# EAGLE design ethernet-frontend (EAGLE 5.09)
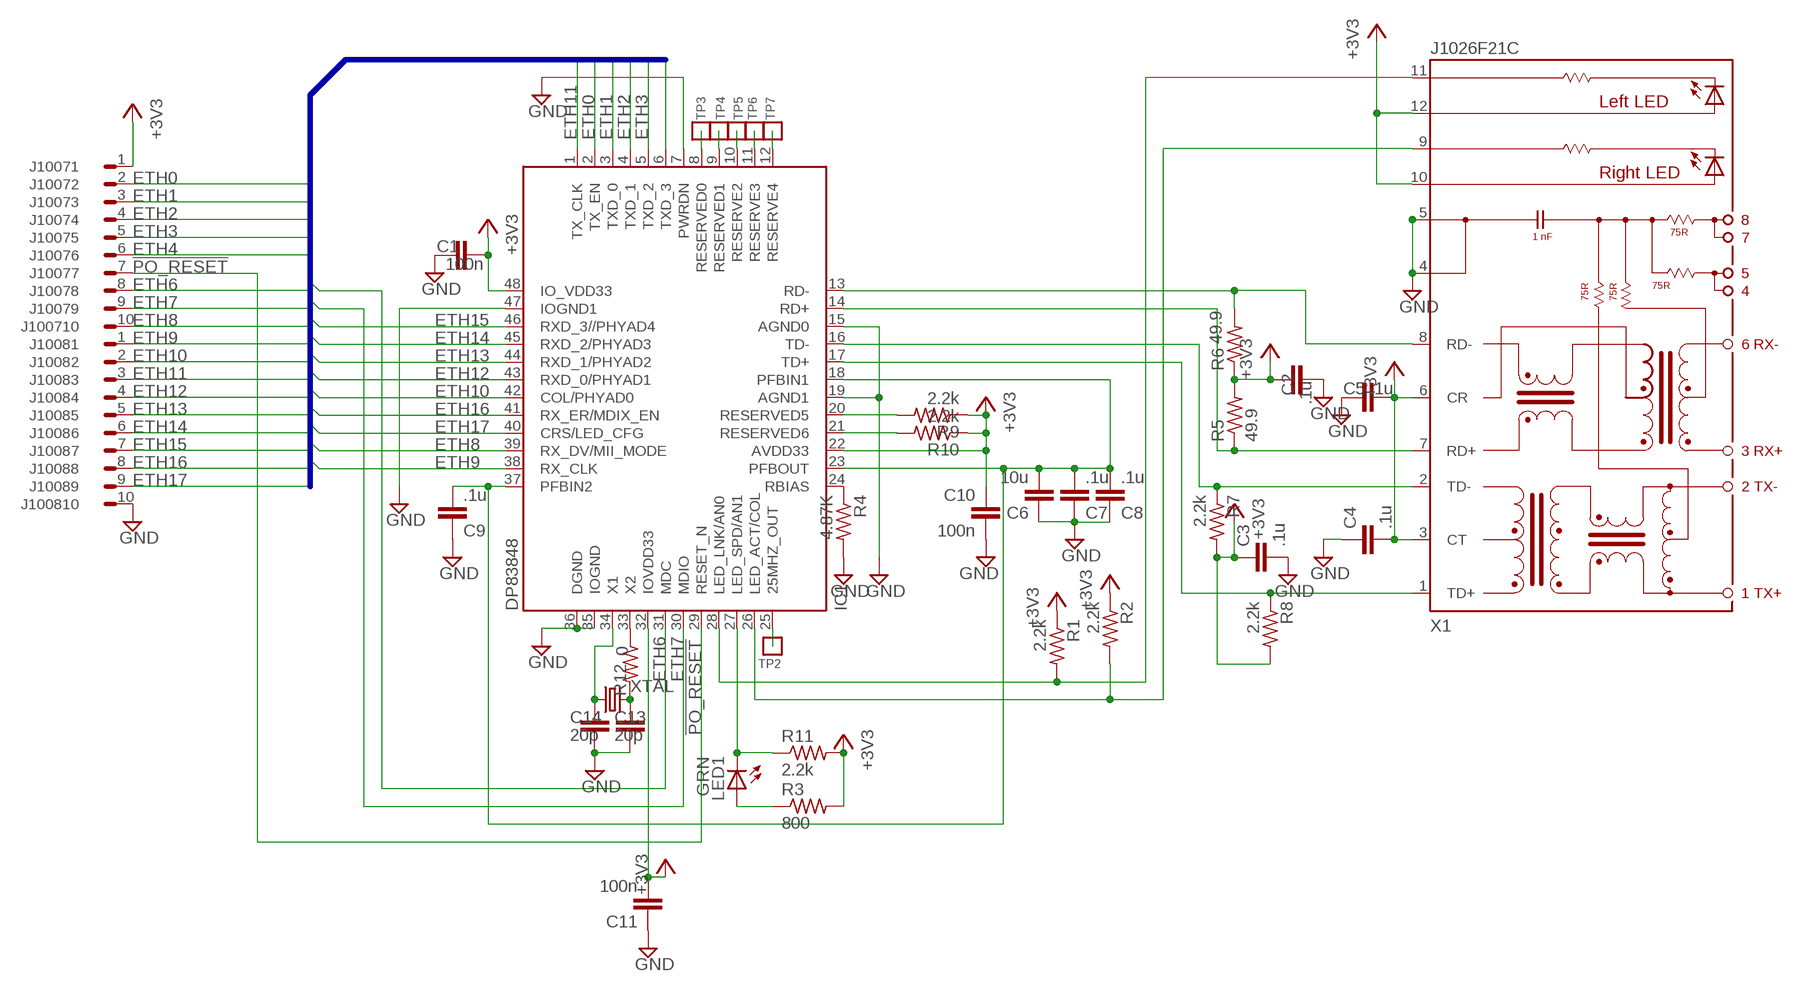
[diagram p0: schematic, sheet 1]

## Parts
C1  100n  C-EU0603-B-NOSILK  [0603-B-NOSILK]
C2  .1u  C-EU0603-B-NOSILK  [0603-B-NOSILK]
C3  .1u  C-EU0603-B-NOSILK  [0603-B-NOSILK]
C4  .1u  C-EU0603-B-NOSILK  [0603-B-NOSILK]
C5  .1u  C-EU0603-B-NOSILK  [0603-B-NOSILK]
C6  10u  C-EU0805-B-NOSILK  [0805-B-NOSILK]
C7  .1u  C-EU0603-B-NOSILK  [0603-B-NOSILK]
C8  .1u  C-EU0603-B-NOSILK  [0603-B-NOSILK]
C9  .1u  C-EU0603-B-NOSILK  [0603-B-NOSILK]
C10  100n  C-EU0603-B-NOSILK  [0603-B-NOSILK]
C11  100n  C-EU0603-B-NOSILK  [0603-B-NOSILK]
C13  20p  C-EU0603-B-NOSILK  [0603-B-NOSILK]
C14  20p  C-EU0603-B-NOSILK  [0603-B-NOSILK]
IC1  DP83848  [LQFP48]
J1007  1_10_CON  [1_10_CON]
J1008  1_10_CON  [1_10_CON]
LED1  GRN  LEDCHIPLED_0603  [CHIPLED_0603]
R1  2.2k  R-US_0603-B-NOSILK  [0603-B-NOSILK]
R2  2.2k  R-US_0603-B-NOSILK  [0603-B-NOSILK]
R3  800  R-US_0603-B-NOSILK  [0603-B-NOSILK]
R4  4.87K  R-US_0603-B-NOSILK  [0603-B-NOSILK]
R5  49.9  R-US_0603-B-NOSILK  [0603-B-NOSILK]
R6  49.9  R-US_0603-B-NOSILK  [0603-B-NOSILK]
R7  2.2k  R-US_0603-B-NOSILK  [0603-B-NOSILK]
R8  2.2k  R-US_0603-B-NOSILK  [0603-B-NOSILK]
R9  2.2k  R-US_0603-B-NOSILK  [0603-B-NOSILK]
R10  2.2k  R-US_0603-B-NOSILK  [0603-B-NOSILK]
R11  2.2k  R-US_0603-B-NOSILK  [0603-B-NOSILK]
R12  0  R-US_0603-B-NOSILK  [0603-B-NOSILK]
TP2  TEST  [TEST]
TP3  TEST  [TEST]
TP4  TEST  [TEST]
TP5  TEST  [TEST]
TP6  TEST  [TEST]
TP7  TEST  [TEST]
X1  J1026F21C  [J1]
XTAL  CRYSTAL_SMD_  [CRYSTAL_SMD]

## Nets
!PO_RESET: IC1.29(RESET_N) J1007.7
+3V3: C1.2 C2.1 C3.1 C4.2 C5.2 C10.1 C11.2 IC1.22(AVDD33) IC1.32(IOVDD33) IC1.48(IO_VDD33) J1007.1 R1.1 R2.1 R3.2 R5.2 R6.1 R7.2 R8.2 R9.1 R10.1 R11.2 X1.3(CT) X1.6(CR) X1.10(A-R) X1.12(A-L)
ETH0: IC1.2(TX_EN) J1007.2
ETH1: IC1.3(TXD_0) J1007.3
ETH2: IC1.4(TXD_1) J1007.4
ETH3: IC1.5(TXD_2) J1007.5
ETH4: IC1.6(TXD_3) J1007.6
ETH6: IC1.31(MDC) J1007.8
ETH7: IC1.30(MDIO) J1007.9
ETH8: IC1.39(RX_DV/MII_MODE) J1007.10
ETH9: IC1.38(RX_CLK) J1008.1
ETH10: IC1.42(COL/PHYAD0) J1008.2
ETH11: IC1.1(TX_CLK) J1008.3
ETH12: IC1.43(RXD_0/PHYAD1) J1008.4
ETH13: IC1.44(RXD_1/PHYAD2) J1008.5
ETH14: IC1.45(RXD_2/PHYAD3) J1008.6
ETH15: IC1.46(RXD_3//PHYAD4) J1008.7
ETH16: IC1.41(RX_ER/MDIX_EN) J1008.8
ETH17: IC1.40(CRS/LED_CFG) J1008.9
GND: C1.1 C2.2 C3.2 C4.1 C5.1 C6.1 C7.1 C8.1 C9.1 C10.2 C11.1 C13.1 C14.1 IC1.7(PWRDN) IC1.15(AGND0) IC1.19(AGND1) IC1.35(IOGND) IC1.36(DGND) IC1.47(IOGND1) J1008.10 R4.2 X1.4 X1.5
N$1: IC1.20(RESERVED5) R9.2
N$2: IC1.24(RBIAS) R4.1
N$3: IC1.16(TD-) R7.1 X1.2(TD-)
N$4: IC1.17(TD+) R8.1 X1.1(TD+)
N$5: IC1.13(RD-) R6.2 X1.8(RD-)
N$6: IC1.14(RD+) R5.1 X1.7(RD+)
N$7: IC1.26(LED_ACT/COL) R2.2 X1.9(C-R)
N$10: IC1.21(RESERVED6) R10.2
N$11: C6.2 C7.2 C8.2 C9.2 IC1.18(PFBIN1) IC1.23(PFBOUT) IC1.37(PFBIN2)
N$12: IC1.28(LED_LNK/AN0) R1.2 X1.11(C-L)
N$13: IC1.27(LED_SPD/AN1) LED1.C R11.1
N$14: LED1.A R3.1
N$16: IC1.25(25MHZ_OUT) TP2.P$1
N$17: IC1.8(RESERVED0) TP3.P$1
N$18: IC1.9(RESERVED1) TP4.P$1
N$19: IC1.10(RESERVE2) TP5.P$1
N$20: IC1.11(RESERVE3) TP6.P$1
N$21: IC1.12(RESERVE4) TP7.P$1
N$22: IC1.33(X2) R12.1
N$23: C13.2 R12.2 XTAL.4
XTAL: C14.2 IC1.34(X1) XTAL.2

## Buses
ETH[0..17]

## Library data of the parts
C1-C11 C13 C14 = rcl_custom:C-EU: CAPACITOR, European symbol
IC1 = national-semiconductor:DP83848: PHYTER® - Extended Temperature Single Port 10/100 Mb/s Ethernet Physical Layer Transceiver Auto generated by make-symbol-device-package-bsdl.ulp Rev. 34 Source: dp83848yb.bsdl http://www.national.com/ds/DP/DP83848VYB.pdf
J1007 J1008 = 1_10_CON:1_10_CON
LED1 = led:LED: LED OSRAM: - CHIPLED LG R971, LG N971, LY N971, LG Q971, LY Q971, LO R971, LY R971 LH N974, LH R974 LS Q976, LO Q976, LY Q976 LO Q996 - Hyper CHIPLED LW Q18S LB Q993, LB Q99A, LB R99A - SideLED LS A670, LO A670, LY A670, LG A670, LP A670 LB A673, LV A673, LT A673, LW A673 LH A674 LY A675 LS A676, LA A676, LO A676, LY A676, LW A676 LS A679, LY A679, LG A679 - Hyper Micro SIDELED® LS Y876, LA Y876, LO Y876, LY Y876 LT Y87S - SmartLED LW L88C, LW L88S LB L89C, LB L89S, LG L890 LS L89K, LO L89K, LY L89K LS L896, LA L896, LO L896, LY L896 - TOPLED LS T670, LO T670, LY T670, LG T670, LP T670 LSG T670, LSP T670, LSY T670, LOP T670, LYG T670 LG T671, LOG T671, LSG T671 LB T673, LV T673, LT T673, LW T673 LH T674 LS T676, LA T676, LO T676, LY T676, LB T676, LH T676, LSB T676, LW T676 LB T67C, LV T67C, LT T67C, LS T67K, LO T67K, LY T67K, LW E67C LS E67B, LA E67B, LO E67B, LY E67B, LB E67C, LV E67C, LT E67C LW T67C LS T679, LY T679, LG T679 LS T770, LO T770, LY T770, LG T770, LP T770 LB T773, LV T773, LT T773, LW T773 LH T774 LS E675, LA E675, LY E675, LS T675 LS T776, LA T776, LO T776, LY T776, LB T776 LHGB T686 LT T68C, LB T68C - Hyper Mini TOPLED® LB M676 - Mini TOPLED Santana® LG M470 LS M47K, LO M47K, LY M47K Source: http://www.osram.convergy.de LUXEON: - LUMILED® LXK2-PW12-R00, LXK2-PW12-S00, LXK2-PW14-U00, LXK2-PW14-V00 LXK2-PM12-R00, LXK2-PM12-S00, LXK2-PM14-U00 LXK2-PE12-Q00, LXK2-PE12-R00, LXK2-PE12-S00, LXK2-PE14-T00, LXK2-PE14-U00 LXK2-PB12-K00, LXK2-PB12-L00, LXK2-PB12-M00, LXK2-PB14-N00, LXK2-PB14-P00, LXK2-PB14-Q00 LXK2-PR12-L00, LXK2-PR12-M00, LXK2-PR14-Q00, LXK2-PR14-R00 LXK2-PD12-Q00, LXK2-PD12-R00, LXK2-PD12-S00 LXK2-PH12-R00, LXK2-PH12-S00 LXK2-PL12-P00, LXK2-PL12-Q00, LXK2-PL12-R00 Source: www.luxeon.com KINGBRIGHT: KA-3528ASYC Source: www.kingbright.com
R1-R12 = rcl_custom:R-US_: RESISTOR, American symbol
TP2-TP7 = tqm1:TEST
X1 = con-pulse:J1026F: PULSEJACK (TM) 1x1 Tab-UP RJ45 10/100 Base-TX RJ45 1x1 Tab-UP with LEDs 8-pin (J1 series) and 6-pin (JP series) integrated magnetics connector, designed to support applications, such as ADSL modems, LAN-on-Motherboard, and Hub and Switches. Source: www.pulseeng.com .. PulseJack-J402.pdf
XTAL = Crystal_Pierre:CRYSTAL_SMD: Crystal

## Board
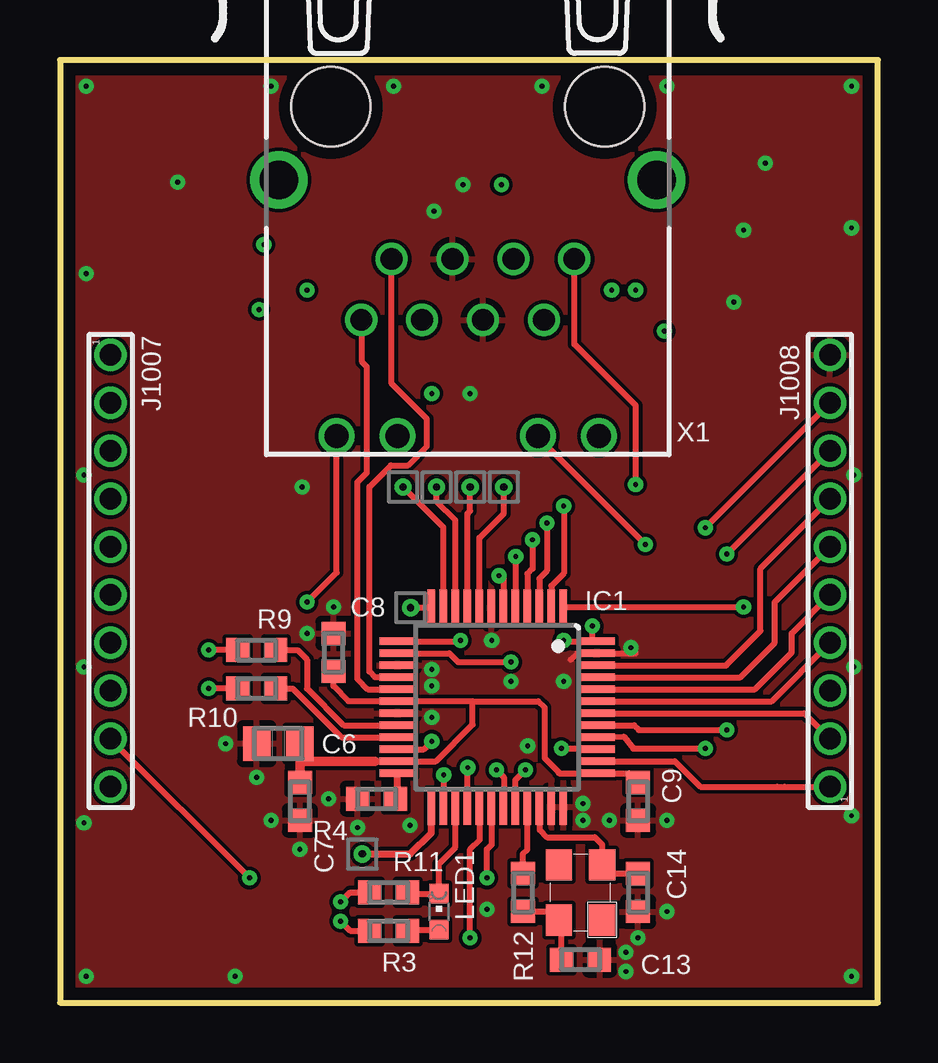
[diagram p1: board, top side]
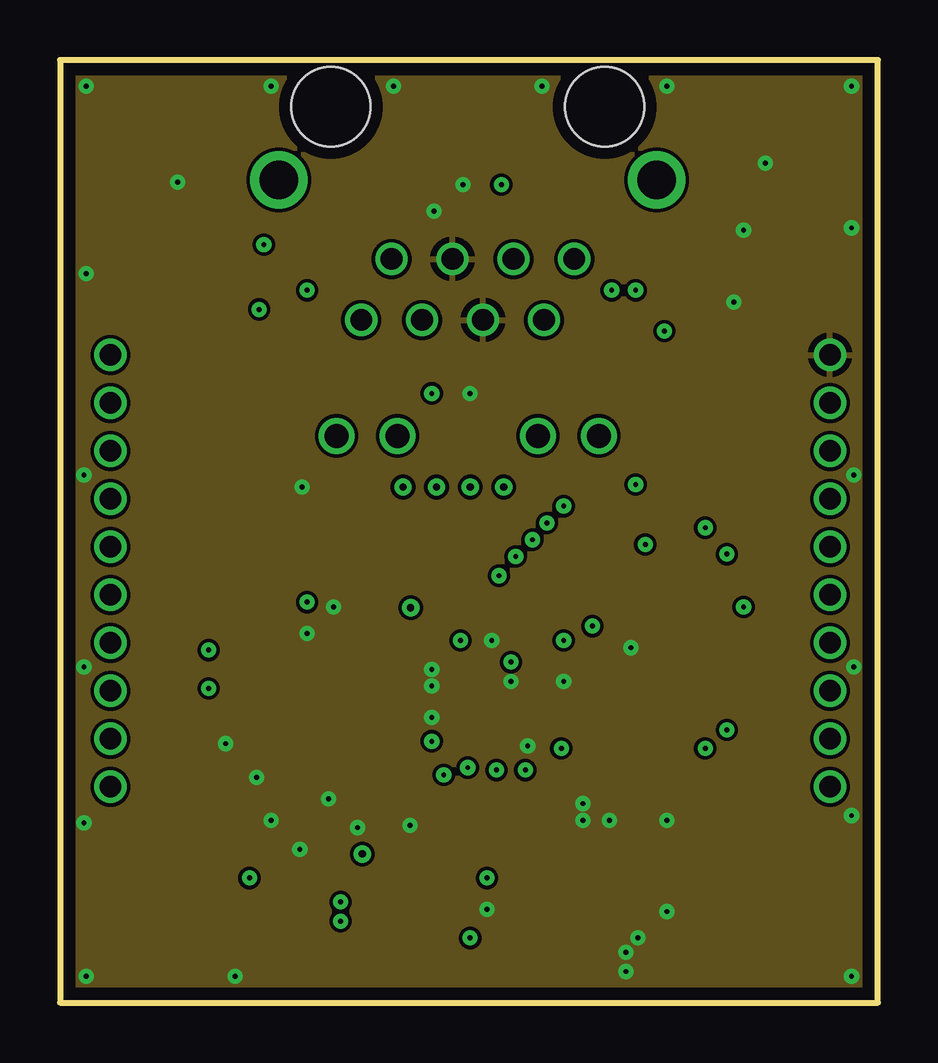
[diagram p2: board, inner layer Route2]
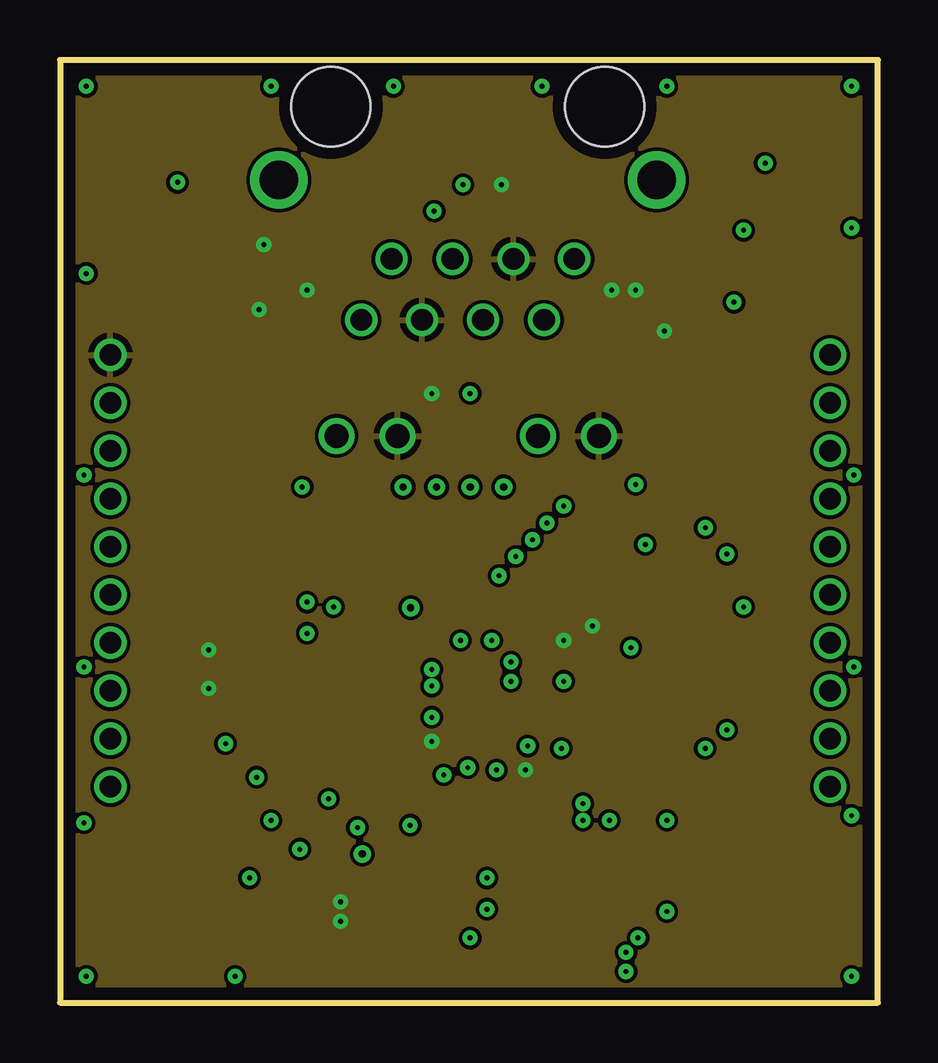
[diagram p3: board, inner layer Route3]
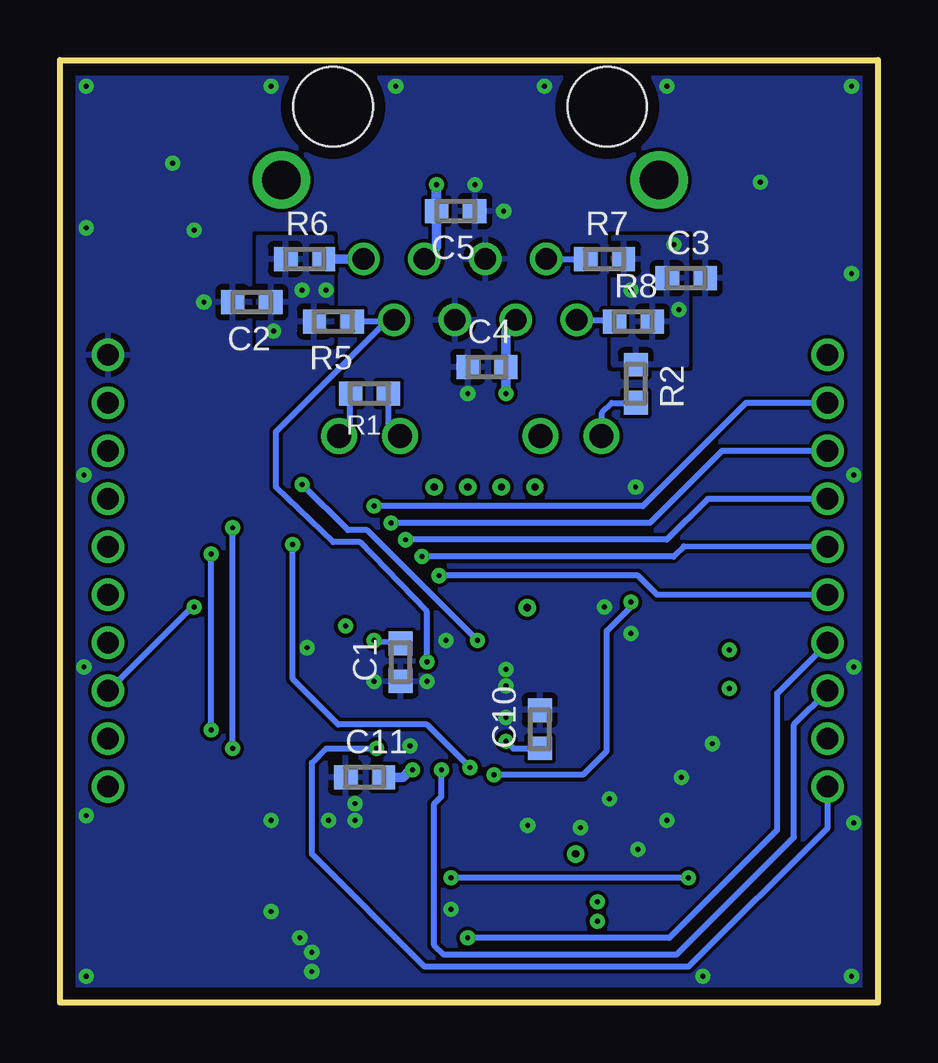
[diagram p4: board, bottom side, seen from below]

Size 34.1 x 39.3 mm. Coordinates in mm from the lower left corner, seen from the top.
Outline: 0,0 34.1,0 34.1,39.3 0,39.3 0,0
Copper layers (1+2*3+16): Top 0.0432mm / dielectric 0.3048mm / Route2 0.0356mm / dielectric 0.7112mm / Route3 0.0356mm / dielectric 0.3048mm / Bottom 0.0432mm
Design rules "sunstone_4lr_rules_v1.3_modifid": minimum track width 6mil, minimum drill 8mil, track to track 6mil, track to pad 6mil, pad to pad 6mil, via to via 6mil, smd to smd 6mil, copper to edge 20mil, drill to drill 16mil, minimum pad ring 0.2118mm, minimum via ring 0.2118mm, stop-mask expansion 3mil, vias tented up to drill 0mil, thermal gap 10mil

### Footprints (pad centres in the part's own frame; a part is rotated, then mirrored left to right if it is on the bottom)
0603-B-NOSILK = smd 0.95 x 1: 1 -0.8,0; 2 0.8,0
0805-B-NOSILK = smd 1.15 x 1.45: 1 -0.9,0; 2 0.9,0
LQFP48 = smd 1.5 x 0.3: 1 -4.15,2.75; 2 -4.15,2.25; 3 -4.15,1.75; 4 -4.15,1.25; 5 -4.15,0.75; 6 -4.15,0.25; 7 -4.15,-0.25; 8 -4.15,-0.75; 9 -4.15,-1.25; 10 -4.15,-1.75; 11 -4.15,-2.25; 12 -4.15,-2.75; 25 4.15,-2.75; 26 4.15,-2.25; 27 4.15,-1.75; 28 4.15,-1.25; 29 4.15,-0.75; 30 4.15,-0.25; 31 4.15,0.25; 32 4.15,0.75; 33 4.15,1.25; 34 4.15,1.75; 35 4.15,2.25; 36 4.15,2.75 | smd 0.3 x 1.5: 13 -2.75,-4.15; 14 -2.25,-4.15; 15 -1.75,-4.15; 16 -1.25,-4.15; 17 -0.75,-4.15; 18 -0.25,-4.15; 19 0.25,-4.15; 20 0.75,-4.15; 21 1.25,-4.15; 22 1.75,-4.15; 23 2.25,-4.15; 24 2.75,-4.15; 37 2.75,4.15; 38 2.25,4.15; 39 1.75,4.15; 40 1.25,4.15; 41 0.75,4.15; 42 0.25,4.15; 43 -0.25,4.15; 44 -0.75,4.15; 45 -1.25,4.15; 46 -1.75,4.15; 47 -2.25,4.15; 48 -2.75,4.15
1_10_CON = drill 0.9 pad 1.27 round: 1 -9,0; 2 -7,0; 3 -5,0; 4 -3,0; 5 -1,0; 6 1,0; 7 3,0; 8 5,0; 9 7,0; 10 9,0
CHIPLED_0603 = smd 0.8 x 0.8: A 0,-0.75; C 0,0.75
TEST = drill 0.3 round: P$1 0,0
J1 = drill 0.9 pad 1.3 round: 1 4.445,2.54; 2 3.175,0; 3 1.905,2.54; 4 0.635,0; 5 -0.635,2.54; 6 -1.905,0; 7 -3.175,2.54; 8 -4.445,0 | drill 1 pad 1.422 round: 9 5.465,7.37; 10 2.925,7.37; 11 -2.925,7.37; 12 -5.465,7.37 | drill 1.6 pad 2.184 round: M1 -7.875,-3.3; M2 7.875,-3.3 | hole 3.3: 5.715,-6.35; -5.715,-6.35
CRYSTAL_SMD = smd 1.3 x 1.1: 1 -1.15,-0.9; 2 1.15,-0.9; 3 1.15,0.9; 4 -1.15,0.9

### Placement (x,y rotation side)
C1  19.9,14.2 90 bottom
C2  26.1,29.2 180 bottom
C3  8,30.2 0 bottom
C4  16.3,26.5 0 bottom
C5  17.6,33 180 bottom
C6  9.1,10.8 0 top
C7  10,8.4 90 top
C8  11.4,14.6 270 top
C9  24.1,8.4 90 top
C10  14.1,11.4 90 bottom
C11  21.4,9.4 0 bottom
C13  21.7,1.8 180 top
C14  24.1,4.6 90 top
IC1  18.23,12.32 270 top
J1007  2.1,18 270 top
J1008  32.1,18 90 top
LED1  15.8,3.8 0 top
R1  21.2,25.4 0 bottom
R2  10.1,25.8 270 bottom
R3  13.7,3 180 top
R4  13.2,8.5 180 top
R5  22.7,28.4 180 bottom
R6  23.9,31 0 bottom
R7  11.4,31 0 bottom
R8  10.2,28.4 0 bottom
R9  8.2,14.7 0 top
R10  8.2,13.1 0 top
R11  13.7,4.6 180 top
R12  19.3,4.6 270 top
TP2  12.6,6.2 180 top
TP3  18.5,21.5 270 top
TP4  17.1,21.5 270 top
TP5  15.7,21.5 270 top
TP6  14.3,21.5 90 top
TP7  14.62,16.47 270 top
X1  17,31 180 top
XTAL  21.7,4.6 90 top

### Tracks (layer width: path | path; a pad name or v marks a point on that pad's centre or on a via)
!PO_RESET  (via drill 0.2)
  Top 0.25: IC1.29 17.5,8.17 17.5,6.8 17.1,6.4 v17.1,2.7
  Bottom 0.25: v17.1,2.7 8.7,2.7 4.2,7.2 4.2,12.9 J1007.7
+3V3  (via drill 0.2)
  Top 0.25: R9.1 v6.2,14.7 | IC1.32 18.98,9.28 v19.4,9.7 | R10.1 7.35,12.95 7.3,13 7.1,13.1 v6.2,13.1 | 21.03,15.07 v21,15.1 21,15.07 22.2,15.07 | 22.2,15.07 IC1.48 | 22.2,15.07 v22.2,15.7 | R11.2 12.1,4.6 v11.7,4.2 | R3.2 12.1,3 v11.7,3.4 | IC1.22 15.17,10.57 v15.5,10.9
  Bottom 0.25: C1.2 20.94,15.04 v21,15.1 | C10.1 15.2,10.6 v15.5,10.9 | R1.1 22,24.09 X1.12
  Bottom 0.4: v19.4,9.7 19.5,9.7 19.8,9.4 C11.2 | v15.5,25.4 C4.2 15.5,28 15.1,28.4 | C5.2 18.4,31.5 18.8,31
  Bottom 0.406: C5.2 v18.4,34.1
  other vias: 24,29.7 25.2,28 23,29.7 8.3,28.9 8.5,31.6 10.3,29.7
  pour Route3 (rank 6): 0,39.3 34.1,39.3 34.1,0 0,0
  pour Bottom: 22.8,31.9 22.8,27.5 25.8,27.5 25.8,31.9
  pour Bottom: 11,26.6 11,31.9 8,31.9 8,26.6
ETH0  (via drill 0.2)
  Top 0.25: IC1.2 20.48,17.38 21,17.9 v21,20.7
  Bottom 0.25: v21,20.7 9.8,20.7 5.5,25 J1007.2
ETH1  (via drill 0.2)
  Top 0.25: 20,16.47 IC1.3 19.98,17.68 20.3,18 v20.3,20
  Bottom 0.25: v20.3,20 9.5,20 6.5,23 J1007.3
ETH2  (via drill 0.2)
  Top 0.25: IC1.4 19.48,17.88 19.7,18.1 v19.7,19.3
  Bottom 0.25: J1007.4 7.1,21 8.8,19.3 v19.7,19.3
ETH3  (via drill 0.2)
  Top 0.25: IC1.5 18.98,18.38 v19,18.6
  Bottom 0.25: J1007.5 8.1,19.02 8.52,18.6 v19,18.6
ETH4  (via drill 0.2)
  Top 0.25: 18.5,16.47 IC1.6 18.48,17.78 v18.3,17.8
  Bottom 0.25: J1007.6 9.2,17 10,17.8 v18.3,17.8
ETH6  (via drill 0.2)
  Top 0.25: IC1.31 18.5,8.17 18.5,9.4 v18.2,9.7
  Bottom 0.25: v18.2,9.7 18.2,8.6 18.5,8.3 18.5,2.4 18.1,2 8.4,2 3.5,6.9 3.5,11.6 J1007.8
ETH7  (via drill 0.2)
  Top 0.25: IC1.30 18,8.17 18,6.6 17.8,6.4 v17.8,5.2 | J1007.9 v7.9,5.2
  Bottom 0.25: v7.9,5.2 v17.8,5.2
ETH8  (via drill 0.2)
  Top 0.25: IC1.39 22.38,10.6 v20.9,10.6
  Bottom 0.25: J1007.10 2.1,7.3 7.9,1.5 18.9,1.5 23.6,6.2 23.6,10 23,10.6 v20.9,10.6
ETH9
  Top 0.25: J1008.1 30.2,9 29.9,9 26.7,9 25.63,10.07 IC1.38
ETH10
  Top 0.25: IC1.42 31.03,12.07 J1008.2
ETH11  (via drill 0.2)
  Top 0.25: IC1.1 21,16.47 21,16.5 v28.5,16.5
  Bottom 0.25: J1008.3 28.6,16.5 v28.5,16.5
ETH12
  Top 0.25: IC1.43 29.67,12.57 J1008.4
ETH13
  Top 0.25: IC1.44 28.97,13.07 30.5,14.6 30.5,15.4 J1008.5
ETH14
  Top 0.25: IC1.45 28.37,13.57 29.8,15 29.8,16.7 J1008.6
ETH15
  Top 0.25: IC1.46 27.8,14.07 27.8,14.1 29.2,15.5 29.2,18.1 J1008.7
ETH16  (via drill 0.2)
  Top 0.25: v27.8,11.37 24.13,11.37 23.93,11.57 IC1.41 | v27.8,18.7 J1008.8
  Bottom 0.25: v27.8,11.37 v27.8,18.7
ETH17  (via drill 0.2)
  Top 0.25: IC1.40 23.5,11.1 23.9,10.6 v26.9,10.6 | v26.9,19.8 J1008.9
  Bottom 0.25: v26.9,10.6 v26.9,19.8
GND  (via drill 0.2)
  Top 0.25: v23.8,14.8 24,14.57 IC1.47 21.57,14.57 21.3,14.3
  other vias: 8.8,38.2 1.1,38.2 33.1,14 33,7.8 21,13.4 11.4,16.5 18,15.1 21.8,8.3 24.1,2.7 23.6,2.1 12.4,7.3 14.6,7.4 33,38.2 17.1,25.4 16.8,34.1 23.6,1.3 25.3,3.8 15.5,11.9 15.5,13.9 21.8,7.6 10,6.4 8.2,9.4 6.9,10.8 8.8,7.6 10.3,15.4 1.1,1.1 33,1.1 13.9,38.2 20.1,38.2 25.3,38.2 1.1,30.4 1,22 1,14 1,7.5 7.3,1.1 33.1,22 33,32.3 15.6,33 28.5,32.2 18.8,13.4 19.5,10.7 25.3,7.6 22.9,7.6 17.8,3.9 11.2,8.5 10.1,21.5 4.9,34.2 29.4,35 28.1,29.2 15.5,13.2
  pour Route2 (rank 6): 0,39.3 34.1,39.3 34.1,0 0,0
  pour Bottom (rank 6): 34.1,0 34.1,39.3 0,39.3 0,0
  pour Top (rank 6): 34.1,0 34.1,39.3 0,39.3 0,0
N$1
  Top 0.25: IC1.20 11.83,11.57 10.3,13.1 10.3,14.3 9.9,14.7 R9.2
N$2
  Top 0.3: IC1.24 14.08,8.58 R4.1
N$3
  Top 0.25: X1.2 13.82,25.8 15.3,24.32 15.3,23.2 14.5,22.4 13.8,22.4 12.9,21.5 12.9,13.8 13.13,13.57 IC1.16
  Bottom 0.25: X1.2 R7.1
N$4
  Top 0.25: IC1.17 12.83,13.07 12.4,13.5 12.4,21.7 12.8,22.1 12.8,26.5 12.6,26.7 12.6,28.41 X1.1
  Bottom 0.25: X1.1 11.06,28.46 R8.1
N$5  (via drill 0.2)
  Top 0.25: X1.8 21.45,27.45 24,24.9 v24,21.6 | IC1.13 16.77,15.07 v16.7,15.1
  Bottom 0.25: v24,21.6 22.1,19.7 21.3,19.7 v16.7,15.1
  Bottom 0.4: X1.8 R6.2
N$6  (via drill 0.2)
  Top 0.25: IC1.14 16.23,14.57 16.6,14.2 v18.8,14.2
  Bottom 0.25: 20.5,28.4 20.23,28.4 X1.7 | 20.5,28.4 R5.1 | v18.8,14.2 18.8,16.3 21.6,19.2 22.7,19.2 25.1,21.5 25.1,23.8 20.5,28.4
N$7  (via drill 0.2)
  Top 0.25: X1.9 11.54,17.93 v10.3,16.7 | IC1.26 15.98,9.38 v16,9.5
  Bottom 0.25: R2.2 11.1,25 11.5,24.6 11.5,23.66 X1.9 | v10.3,16.7 10.3,16.5 11.3,15.5 11.3,10.5 12.3,9.5 v16,9.5
N$10
  Top 0.25: IC1.21 11.73,11.07 9.7,13.1 R10.2
N$11
  Top 0.25: 17.2,12.57 IC1.18 12.03,12.57 11.4,13.2 C8.2 | 17.2,12.57 19.93,12.57 20.2,12.3 20.2,10.2 20.8,9.6 20.8,9.57 IC1.37 23.73,9.57 C9.2 | 17.2,12.57 17.2,11.6 15.67,10.07 IC1.23 13.13,10.07
  Top 0.4: 13.13,10.07 10.03,10.07 10,10.1 C6.2 C7.2
N$12  (via drill 0.2)
  Top 0.25: X1.11 19.93,23.57 v24.4,19.1 | IC1.28 16.98,9.48 v17,9.8
  Bottom 0.25: R1.2 20.4,24.11 X1.11 | v24.4,19.1 24.4,13.5 22.5,11.6 18.8,11.6 v17,9.8
N$13
  Top 0.25: IC1.27 16.48,6.48 15.8,5.8 LED1.C 14.55,4.55 R11.1
N$14
  Top 0.25: LED1.A 14.55,3.05 R3.1
N$16
  Top 0.25: IC1.25
  Top 0.3: IC1.25 15.48,7.08 14.6,6.2 TP2.P$1
N$17
  Top 0.25: IC1.8 17.48,19.38 18.5,20.4 TP3.P$1
N$18
  Top 0.25: IC1.9 16.98,20.38 17.1,20.5 TP4.P$1
N$19
  Top 0.25: IC1.10 16.48,20.12 15.7,20.9 TP5.P$1
N$20
  Top 0.25: IC1.11 15.98,19.82 TP6.P$1
N$21
  Top 0.25: TP7.P$1 IC1.12
N$22
  Top 0.25: IC1.33 19.48,6.38 19.3,6.2 R12.1
N$23
  Top 0.25: XTAL.4 20.89,3.61 | R12.2 20.45,3.8 XTAL.4 | C13.2 20.9,3.35 XTAL.4
XTAL
  Top 0.25: C14.2 22.95,5.4 XTAL.2 22.6,6.6 22.3,6.9 20.3,6.9 20,7.2 20,8.15 IC1.34